# Altium schematic sheet GumstixInterface.SchDoc
size C
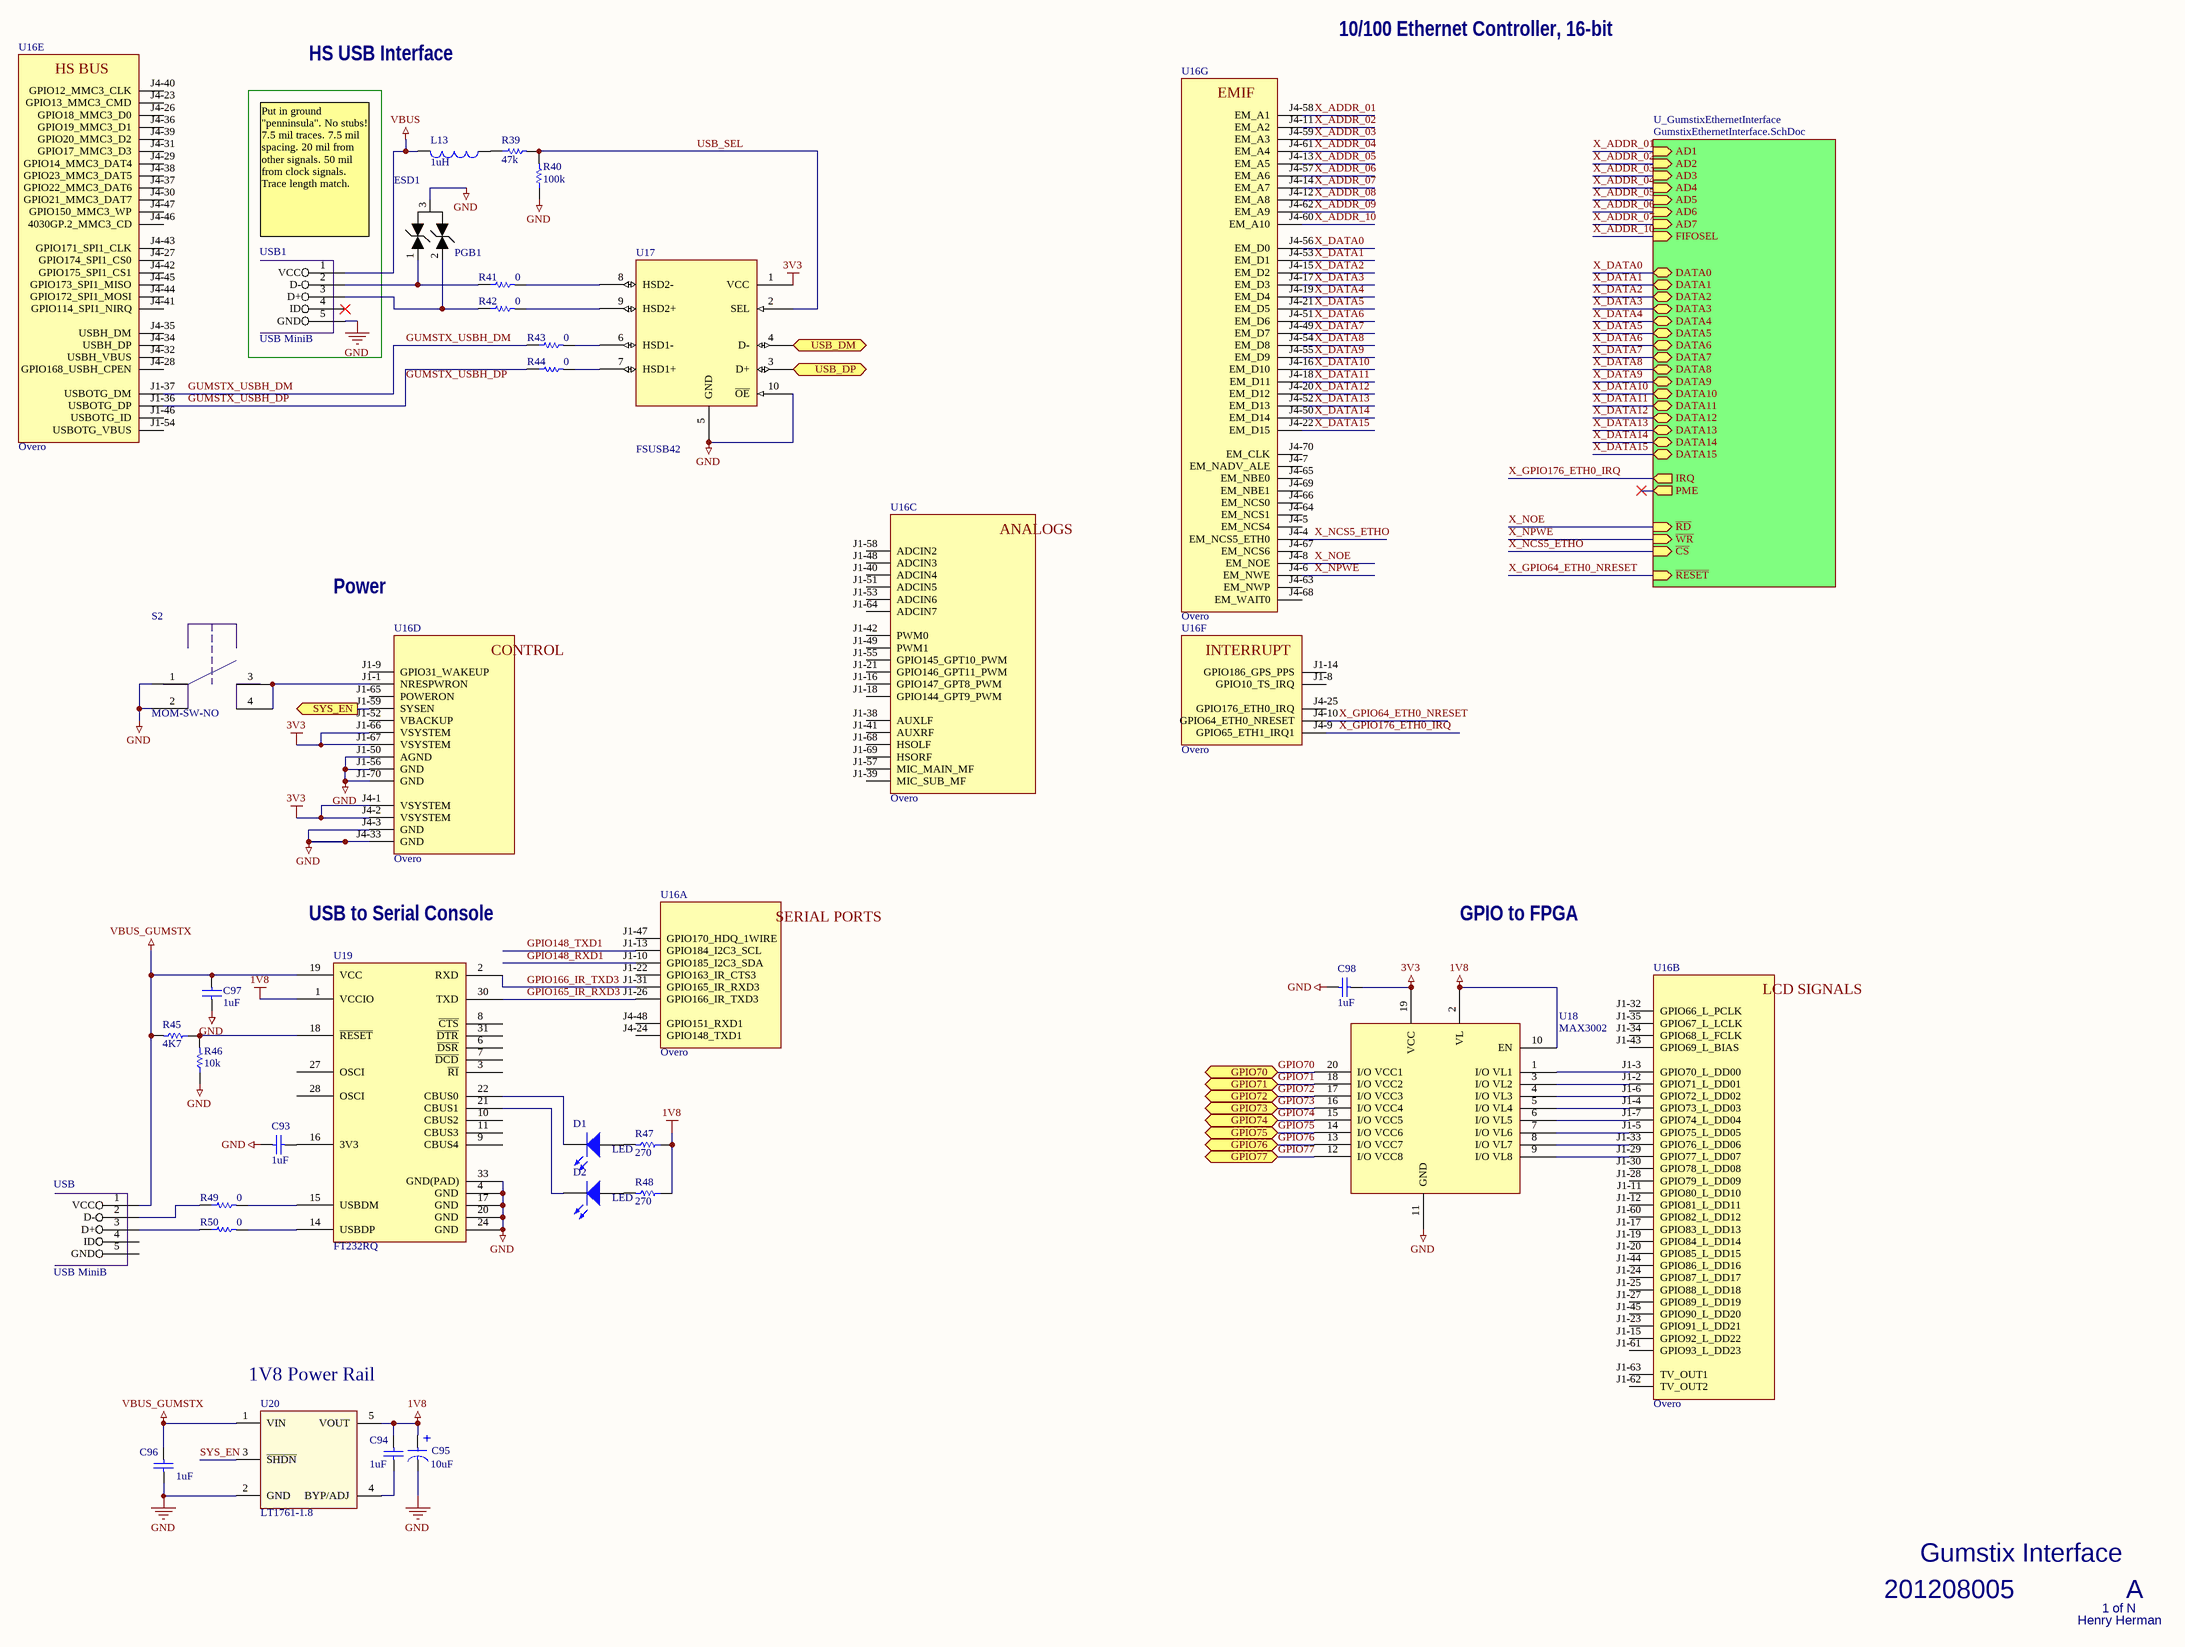
[diagram p0: GumstixInterface.SchDoc]

## Parts
C93  Label: 1uF  [SM/C_0603]  (hidden comment: CAP)
C94  Label: 1uF  [SM/C_0603]  (hidden comment: CAP)
C95  Label: 10uF  [SM/C_POL_0805]  (hidden comment: CAP_POL)
C96  Label: 1uF  [SM/C_0603]  (hidden comment: CAP)
C97  Label: 1uF  [SM/C_0603]  (hidden comment: CAP)
C98  Label: 1uF  [SM/C_0603]  (hidden comment: CAP)
D1  LED  [LED-1206]
D2  LED  [LED-1206]
ESD1  PGB1  [SOT23-PGB1-ESD]
L13  value 1uH  [SM/L_0805]  (hidden comment: Inductor)
R39  value 47k  [SM/R_0603]  (hidden comment: Res)
R40  value 100k  [SM/R_0603]  (hidden comment: Res)
R41  value 0  [SM/R_0603]  (hidden comment: Res)
R42  value 0  [SM/R_0603]  (hidden comment: Res)
R43  value 0  [SM/R_0603]  (hidden comment: Res)
R44  value 0  [SM/R_0603]  (hidden comment: Res)
R45  value 4K7  [SM/R_0603]  (hidden comment: Res)
R46  value 10k  [SM/R_0603]  (hidden comment: Res)
R47  value 270  [SM/R_0603]  (hidden comment: Res)
R48  value 270  [SM/R_0603]  (hidden comment: Res)
R49  value 0  [SM/R_0603]  (hidden comment: Res)
R50  value 0  [SM/R_0603]  (hidden comment: Res)
S2  MOM-SW-NO  [MOM-SW]
U16  Overo  [OVERO]  (parts A,B,C,D,E,F,G of 7)
U17  FSUSB42  [MSOP-10LEAD-FairchildSemi-USBMux]
U18  MAX3002  [TSSOP-20Lead-MAXIM]
U19  FT232RQ  [QFN32-FT232RQ]
U20  LT1761-1.8  [TSOT-23-5Lead-LTC3406A]
USB  USB MiniB  [USB-MINIB]
USB1  USB MiniB  [USB-MINIB]

## Sub-sheets
U_GumstixEthernetInterface = GumstixEthernetInterface.SchDoc: AD1 (in), AD2 (in), AD3 (in), AD4 (in), AD5 (in), AD6 (in), AD7 (in), DATA0 (bidir), DATA1 (bidir), DATA2 (bidir), DATA3 (bidir), DATA4 (bidir), DATA5 (bidir), DATA6 (bidir), DATA7 (bidir), DATA8 (bidir), DATA9 (bidir), DATA10 (bidir), DATA11 (bidir), DATA12 (bidir), DATA13 (bidir), DATA14 (bidir), DATA15 (bidir), ~{RD} (in), ~{WR} (in), ~{CS} (in), IRQ (out), FIFOSEL (in), PME (out), ~{RESET} (in)

## Ports
GPIO70 (bidir), GPIO71 (bidir), GPIO72 (bidir), GPIO73 (bidir), GPIO74 (bidir), GPIO75 (bidir), GPIO76 (bidir), GPIO77 (bidir), SYS_EN (out), USB_DM (bidir), USB_DP (bidir)

## Nets
1V8: C94.2 C95.1 R47.1 R48.1 U18.2(VL) U18.10(EN) U19.1(VCCIO) U20.5(VOUT)
3V3: C98.2 U16.J1-66(VSYSTEM) U16.J1-67(VSYSTEM) U16.J4-1(VSYSTEM) U16.J4-2(VSYSTEM) U17.1(VCC) U18.19(VCC)
GND: C93.2 C95.2 C96.1 C97.2 C98.1 ESD1.3 R40.1 R46.1 S2.1 S2.2 U16.J1-50(AGND) U16.J1-56(GND) U16.J1-70(GND) U16.J4-3(GND) U16.J4-33(GND) U17.5(GND) U17.10(~{OE}) U18.11(GND) U19.4(GND) U19.17(GND) U19.20(GND) U19.24(GND) U19.33(GND(PAD)) U20.2(GND) USB1.5(GND)
VBUS: L13.2 USB1.1(VCC)
VBUS_GUMSTX: C96.2 C97.1 R45.2 U19.19(VCC) U20.1(VIN) USB.1(VCC)
GPIO70: U18.20(I/O_VCC1) ; port GPIO70
GPIO71: U18.18(I/O_VCC2) ; port GPIO71
GPIO72: U18.17(I/O_VCC3) ; port GPIO72
GPIO73: U18.16(I/O_VCC4) ; port GPIO73
GPIO74: U18.15(I/O_VCC5) ; port GPIO74
GPIO75: U18.14(I/O_VCC6) ; port GPIO75
GPIO76: U18.13(I/O_VCC7) ; port GPIO76
GPIO77: U18.12(I/O_VCC8) ; port GPIO77
GPIO148_RXD1: U16.J1-10(GPIO185_I2C3_SDA)
GPIO148_TXD1: U16.J1-13(GPIO184_I2C3_SCL)
GPIO165_IR_RXD3: U16.J1-26(GPIO166_IR_TXD3) U19.30(TXD)
GPIO166_IR_TXD3: U16.J1-31(GPIO165_IR_RXD3) U19.2(RXD)
GUMSTX_USBH_DM: R43.1 U16.J1-37(USBOTG_DM)
GUMSTX_USBH_DP: R44.1 U16.J1-36(USBOTG_DP)
SYS_EN: U16.J1-59(SYSEN) ; port SYS_EN
SYS_EN: U20.3(~{SHDN})  [a separate net that carries the same name]
USB_DM: U17.4(D-) ; port USB_DM
USB_DP: U17.3(D+) ; port USB_DP
USB_SEL: R39.2 R40.2 U17.2(SEL)
X_ADDR_01: U16.J4-58(EM_A1) ; sheet U_GumstixEthernetInterface/AD1
X_ADDR_02: U16.J4-11(EM_A2) ; sheet U_GumstixEthernetInterface/AD2
X_ADDR_03: U16.J4-59(EM_A3) ; sheet U_GumstixEthernetInterface/AD3
X_ADDR_04: U16.J4-61(EM_A4) ; sheet U_GumstixEthernetInterface/AD4
X_ADDR_05: U16.J4-13(EM_A5) ; sheet U_GumstixEthernetInterface/AD5
X_ADDR_06: U16.J4-57(EM_A6) ; sheet U_GumstixEthernetInterface/AD6
X_ADDR_07: U16.J4-14(EM_A7) ; sheet U_GumstixEthernetInterface/AD7
X_ADDR_08: U16.J4-12(EM_A8)
X_ADDR_09: U16.J4-62(EM_A9)
X_ADDR_10: U16.J4-60(EM_A10) ; sheet U_GumstixEthernetInterface/FIFOSEL
X_DATA0: U16.J4-56(EM_D0) ; sheet U_GumstixEthernetInterface/DATA0
X_DATA1: U16.J4-53(EM_D1) ; sheet U_GumstixEthernetInterface/DATA1
X_DATA2: U16.J4-15(EM_D2) ; sheet U_GumstixEthernetInterface/DATA2
X_DATA3: U16.J4-17(EM_D3) ; sheet U_GumstixEthernetInterface/DATA3
X_DATA4: U16.J4-19(EM_D4) ; sheet U_GumstixEthernetInterface/DATA4
X_DATA5: U16.J4-21(EM_D5) ; sheet U_GumstixEthernetInterface/DATA5
X_DATA6: U16.J4-51(EM_D6) ; sheet U_GumstixEthernetInterface/DATA6
X_DATA7: U16.J4-49(EM_D7) ; sheet U_GumstixEthernetInterface/DATA7
X_DATA8: U16.J4-54(EM_D8) ; sheet U_GumstixEthernetInterface/DATA8
X_DATA9: U16.J4-55(EM_D9) ; sheet U_GumstixEthernetInterface/DATA9
X_DATA10: U16.J4-16(EM_D10) ; sheet U_GumstixEthernetInterface/DATA10
X_DATA11: U16.J4-18(EM_D11) ; sheet U_GumstixEthernetInterface/DATA11
X_DATA12: U16.J4-20(EM_D12) ; sheet U_GumstixEthernetInterface/DATA12
X_DATA13: U16.J4-52(EM_D13) ; sheet U_GumstixEthernetInterface/DATA13
X_DATA14: U16.J4-50(EM_D14) ; sheet U_GumstixEthernetInterface/DATA14
X_DATA15: U16.J4-22(EM_D15) ; sheet U_GumstixEthernetInterface/DATA15
X_GPIO64_ETH0_NRESET: U16.J4-10(GPIO64_ETH0_NRESET) ; sheet U_GumstixEthernetInterface/~{RESET}
X_GPIO176_ETH0_IRQ: U16.J4-9(GPIO65_ETH1_IRQ1) ; sheet U_GumstixEthernetInterface/IRQ
X_NCS5_ETHO: U16.J4-4(EM_NCS5_ETH0) ; sheet U_GumstixEthernetInterface/~{CS}
X_NOE: U16.J4-8(EM_NOE) ; sheet U_GumstixEthernetInterface/~{RD}
X_NPWE: U16.J4-6(EM_NWE) ; sheet U_GumstixEthernetInterface/~{WR}
NetC93_1: C93.1 U19.16(3V3)
NetC94_1: C94.1 U20.4(BYP/ADJ)
NetD1_1: D1.1(A) R47.2
NetD1_2: D1.2(K) U19.22(CBUS0)
NetD2_1: D2.1(A) R48.2
NetD2_2: D2.2(K) U19.21(CBUS1)
NetESD1_1: ESD1.1 R41.1 USB1.2(D-)
NetESD1_2: ESD1.2 R42.1 USB1.3(D+)
NetL13_1: L13.1 R39.1
NetR41_2: R41.2 U17.8(HSD2-)
NetR42_2: R42.2 U17.9(HSD2+)
NetR43_2: R43.2 U17.6(HSD1-)
NetR44_2: R44.2 U17.7(HSD1+)
NetR45_1: R45.1 R46.2 U19.18(~{RESET})
NetR49_1: R49.1 USB.2(D-)
NetR49_2: R49.2 U19.15(USBDM)
NetR50_1: R50.1 USB.3(D+)
NetR50_2: R50.2 U19.14(USBDP)
NetS2_3: S2.3 S2.4 U16.J1-1(NRESPWRON)
NetU16_J1-2: U16.J1-2(GPIO71_L_DD01) U18.3(I/O_VL2)
NetU16_J1-3: U16.J1-3(GPIO70_L_DD00) U18.1(I/O_VL1)
NetU16_J1-4: U16.J1-4(GPIO73_L_DD03) U18.5(I/O_VL4)
NetU16_J1-5: U16.J1-5(GPIO75_L_DD05) U18.7(I/O_VL6)
NetU16_J1-6: U16.J1-6(GPIO72_L_DD02) U18.4(I/O_VL3)
NetU16_J1-7: U16.J1-7(GPIO74_L_DD04) U18.6(I/O_VL5)
NetU16_J1-29: U16.J1-29(GPIO77_L_DD07) U18.9(I/O_VL8)
NetU16_J1-33: U16.J1-33(GPIO76_L_DD06) U18.8(I/O_VL7)

Not connected (* = marked no-connect by the designer): U16 J1-8(GPIO10_TS_IRQ) J1-9(GPIO31_WAKEUP) J1-11(GPIO80_L_DD10) J1-12(GPIO81_L_DD11) J1-14(GPIO186_GPS_PPS) J1-15(GPIO92_L_DD22) J1-16(GPIO147_GPT8_PWM) J1-17(GPIO83_L_DD13) J1-18(GPIO144_GPT9_PWM) J1-19(GPIO84_L_DD14) J1-20(GPIO85_L_DD15) J1-21(GPIO146_GPT11_PWM) J1-22(GPIO163_IR_CTS3) J1-23(GPIO91_L_DD21) J1-24(GPIO87_L_DD17) J1-25(GPIO88_L_DD18) J1-27(GPIO89_L_DD19) J1-28(GPIO79_L_DD09) J1-30(GPIO78_L_DD08) J1-32(GPIO66_L_PCLK) J1-34(GPIO68_L_FCLK) J1-35(GPIO67_L_LCLK) J1-38(AUXLF) J1-39(MIC_SUB_MF) J1-40(ADCIN4) J1-41(AUXRF) J1-42(PWM0) J1-43(GPIO69_L_BIAS) J1-44(GPIO86_L_DD16) J1-45(GPIO90_L_DD20) J1-46(USBOTG_ID) J1-47(GPIO170_HDQ_1WIRE) J1-48(ADCIN3) J1-49(PWM1) J1-51(ADCIN5) J1-52(VBACKUP) J1-53(ADCIN6) J1-54(USBOTG_VBUS) J1-55(GPIO145_GPT10_PWM) J1-57(MIC_MAIN_MF) J1-58(ADCIN2) J1-60(GPIO82_L_DD12) J1-61(GPIO93_L_DD23) J1-62(TV_OUT2) J1-63(TV_OUT1) J1-64(ADCIN7) J1-65(POWERON) J1-68(HSOLF) J1-69(HSORF) J4-5(EM_NCS4) J4-7(EM_NADV_ALE) J4-23(GPIO13_MMC3_CMD) J4-24(GPIO148_TXD1) J4-25(GPIO176_ETH0_IRQ) J4-26(GPIO18_MMC3_D0) J4-27(GPIO174_SPI1_CS0) J4-28(GPIO168_USBH_CPEN) J4-29(GPIO14_MMC3_DAT4) J4-30(GPIO21_MMC3_DAT7) J4-31(GPIO17_MMC3_D3) J4-32(USBH_VBUS) J4-34(USBH_DP) J4-35(USBH_DM) J4-36(GPIO19_MMC3_D1) J4-37(GPIO22_MMC3_DAT6) J4-38(GPIO23_MMC3_DAT5) J4-39(GPIO20_MMC3_D2) J4-40(GPIO12_MMC3_CLK) J4-41(GPIO114_SPI1_NIRQ) J4-42(GPIO175_SPI1_CS1) J4-43(GPIO171_SPI1_CLK) J4-44(GPIO172_SPI1_MOSI) J4-45(GPIO173_SPI1_MISO) J4-46(4030GP.2_MMC3_CD) J4-47(GPIO150_MMC3_WP) J4-48(GPIO151_RXD1) J4-63(EM_NWP) J4-64(EM_NCS1) J4-65(EM_NBE0) J4-66(EM_NCS0) J4-67(EM_NCS6) J4-68(EM_WAIT0) J4-69(EM_NBE1) J4-70(EM_CLK); U19 3(~{RI}) 6(~{DSR}) 7(~{DCD}) 8(~{CTS}) 9(CBUS4) 10(CBUS2) 11(CBUS3) 27(OSCI) 28(OSCI) 31(~{DTR}); USB 4(ID) 5(GND); USB1 4(ID)*

## Notes on the sheet
- 10/100 Ethernet Controller, 16-bit
- HS USB Interface
- Put in ground "penninsula". No stubs! 7.5 mil traces. 7.5 mil spacing. 20 mil from other signals. 50 mil from clock signals.
  Trace length match.
- Power
- USB to Serial Console
- GPIO to FPGA
- (near U20) 1V8 Power Rail
- Gumstix Interface
- 201208005
- Henry Herman
- 1 of N
- A
- (in symbol Overo, part A) SERIAL PORTS
- (in symbol Overo, part B) LCD SIGNALS
- (in symbol Overo, part C) ANALOGS
- (in symbol Overo, part D) CONTROL
- (in symbol Overo, part E) HS BUS
- (in symbol Overo, part F) INTERRUPT
- (in symbol Overo, part G) EMIF

## Library data of the parts
C93 C94 C96-C98 = CAP: Value: 1uF
C95 = CAP_POL: CAP; Value: 10uF
ESD1 = PGB102ST23
R39-R50 = Res: Resistor; Published: 8-Jun-2000; LatestRevisionDate: 17-Jul-2002; LatestRevisionNote: Re-released for DXP Platform.; PackageReference: AXIAL-0.3; Publisher: Altium Limited
S2 = MOM-BUT
U16 = Overo: Gumstix Overo COM
U19 = FT232R
U20 = LT1761-X
USB USB1 = USB MiniB: Mini USB; Published: 8-Jun-2000; LatestRevisionDate: 17-Jan-2003; LatestRevisionNote: PCB Footprint 'BCY-W3/D4.7' replaced; DatasheetDocument: 1997; PackageDocument: Sep-1998; PackageReference: TO-92A; Publisher: Altium Limited; ComponentLink1Description: Manufacturer Link; ComponentLink1URL: http://www.fairchildsemi.com/; ComponentLink2Description: Datasheet; ComponentLink2URL: http://www.fairchildsemi.com/ds/2N%2F2N3904.pdf